# EAGLE design untitled (EAGLE 6.3)
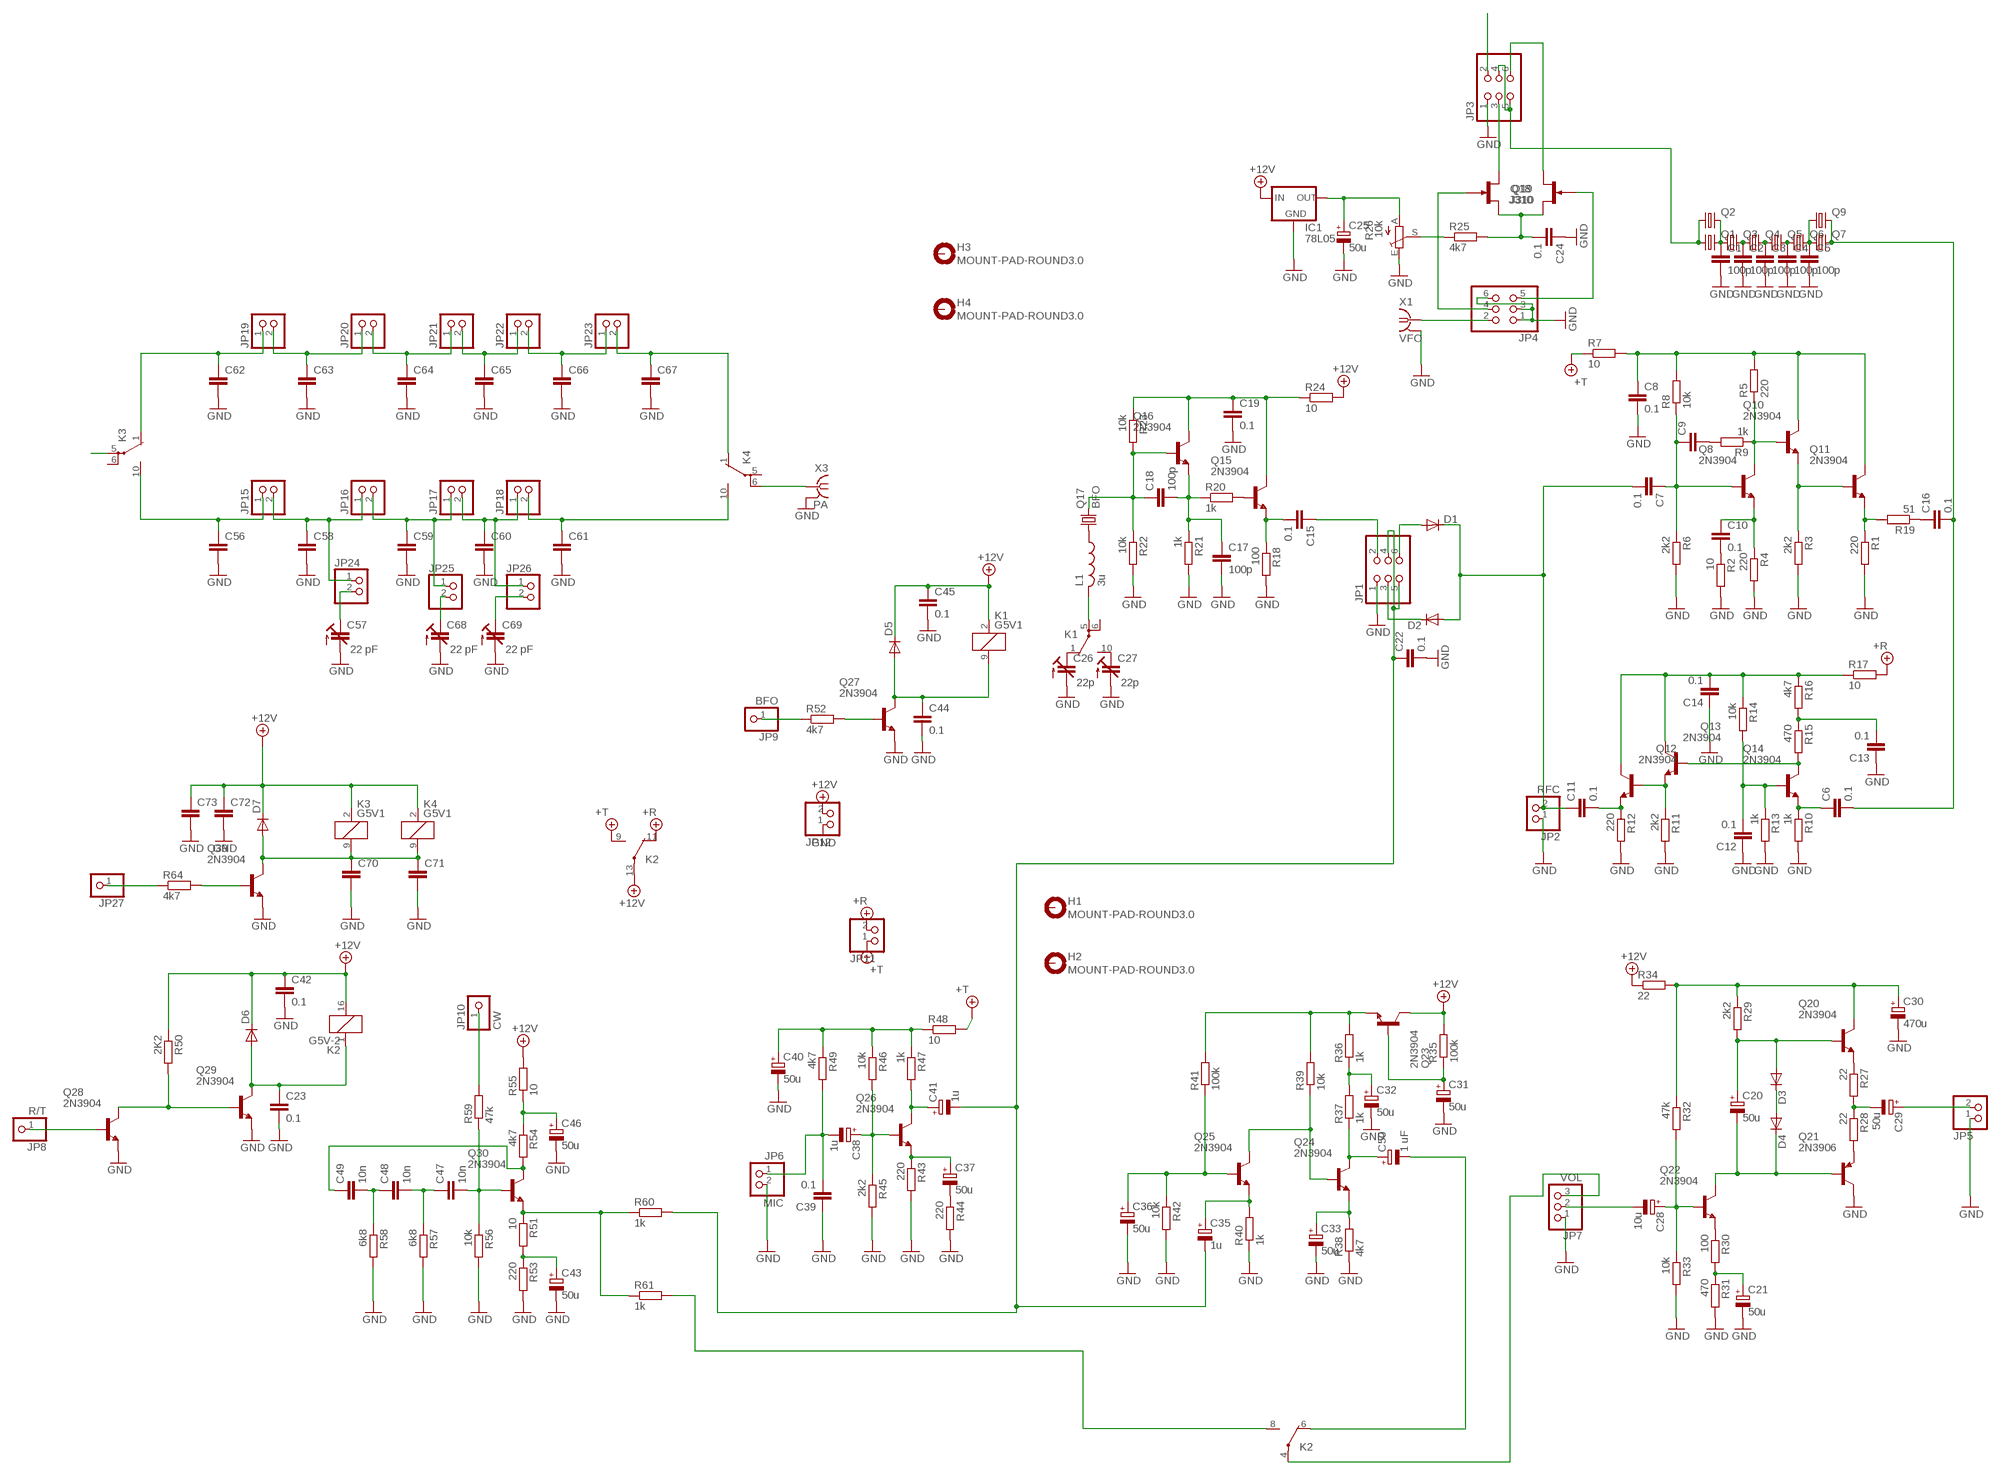
[diagram p0: schematic, sheet 1]

## Parts
C1  100p  C-EUC1206  [C1206]
C2  100p  C-EUC1206  [C1206]
C3  100p  C-EUC1206  [C1206]
C4  100p  C-EUC1206  [C1206]
C5  100p  C-EUC1206  [C1206]
C6  0.1  C-EU050-024X044  [C050-024X044]
C7  0.1  C-EU050-024X044  [C050-024X044]
C8  0.1  C-EU050-024X044  [C050-024X044]
C9  C-EU050-024X044  [C050-024X044]
C10  0.1  C-EU050-024X044  [C050-024X044]
C11  0.1  C-EU050-024X044  [C050-024X044]
C12  0.1  C-EU050-024X044  [C050-024X044]
C13  0.1  C-EU050-024X044  [C050-024X044]
C14  0.1  C-EU050-024X044  [C050-024X044]
C15  0.1  C-EU050-024X044  [C050-024X044]
C16  0.1  C-EU050-024X044  [C050-024X044]
C17  100p  C-EU050-024X044  [C050-024X044]
C18  100p  C-EU050-024X044  [C050-024X044]
C19  0.1  C-EU050-024X044  [C050-024X044]
C20  50u  CPOL-EUE2.5-5  [E2,5-5]
C21  50u  CPOL-EUE2.5-5  [E2,5-5]
C22  0.1  C-EU050-024X044  [C050-024X044]
C23  0.1  C-EU050-024X044  [C050-024X044]
C24  0.1  C-EU050-024X044  [C050-024X044]
C25  50u  CPOL-EUE2.5-5  [E2,5-5]
C26  22p  C-TRIMMTZ03  [CTRIMTZ03]
C27  22p  C-TRIMMTZ03  [CTRIMTZ03]
C28  10u  CPOL-EUE2.5-5  [E2,5-5]
C29  50u  CPOL-EUE2.5-5  [E2,5-5]
C30  470u  CPOL-EUE2.5-5  [E2,5-5]
C31  50u  CPOL-EUE2.5-5  [E2,5-5]
C32  50u  CPOL-EUE2.5-5  [E2,5-5]
C33  50u  CPOL-EUE2.5-5  [E2,5-5]
C35  1u  CPOL-EUE2.5-5  [E2,5-5]
C36  50u  CPOL-EUE2.5-5  [E2,5-5]
C37  50u  CPOL-EUE2.5-5  [E2,5-5]
C38  1u  CPOL-EUE2.5-5  [E2,5-5]
C39  0.1  C-EU050-024X044  [C050-024X044]
C40  50u  CPOL-EUE2.5-5  [E2,5-5]
C41  1u  CPOL-EUE2.5-5  [E2,5-5]
C42  0.1  C-EU050-024X044  [C050-024X044]
C43  50u  CPOL-EUE2.5-5  [E2,5-5]
C44  0.1  C-EU050-024X044  [C050-024X044]
C45  0.1  C-EU050-024X044  [C050-024X044]
C46  50u  CPOL-EUE2.5-5  [E2,5-5]
C47  10n  C-EU050-024X044  [C050-024X044]
C48  10n  C-EU050-024X044  [C050-024X044]
C49  10n  C-EU050-024X044  [C050-024X044]
C50  1 uF  CPOL-EUE5-4  [E5-4]
C56  C-EU050-024X044  [C050-024X044]
C57  22 pF  C-TRIMMTZ03  [CTRIMTZ03]
C58  C-EU050-024X044  [C050-024X044]
C59  C-EU050-024X044  [C050-024X044]
C60  C-EU050-024X044  [C050-024X044]
C61  C-EU050-024X044  [C050-024X044]
C62  C-EU050-024X044  [C050-024X044]
C63  C-EU050-024X044  [C050-024X044]
C64  C-EU050-024X044  [C050-024X044]
C65  C-EU050-024X044  [C050-024X044]
C66  C-EU050-024X044  [C050-024X044]
C67  C-EU050-024X044  [C050-024X044]
C68  22 pF  C-TRIMMTZ03  [CTRIMTZ03]
C69  22 pF  C-TRIMMTZ03  [CTRIMTZ03]
C70  C-EU050-024X044  [C050-024X044]
C71  C-EU050-024X044  [C050-024X044]
C72  C-EU050-024X044  [C050-024X044]
C73  C-EU050-024X044  [C050-024X044]
D1  DIODE-D-5  [D-5]
D2  DIODE-D-5  [D-5]
D3  DIODE-D-5  [D-5]
D4  DIODE-D-5  [D-5]
D5  DIODE-D-5  [D-5]
D6  DIODE-D-5  [D-5]
D7  DIODE-D-5  [D-5]
H1  MOUNT-PAD-ROUND3.0  [3,0-PAD]
H2  MOUNT-PAD-ROUND3.0  [3,0-PAD]
H3  MOUNT-PAD-ROUND3.0  [3,0-PAD]
H4  MOUNT-PAD-ROUND3.0  [3,0-PAD]
IC1  78L05  78LXX  [78LXX]
JP1  PINHD-2X3  [2X03]
JP2  RFC  PINHD-1X2  [1X02]
JP3  PINHD-2X3  [2X03]
JP4  PINHD-2X3  [2X03]
JP5  PINHD-1X2  [1X02]
JP6  MIC  PINHD-1X2  [1X02]
JP7  VOL  PINHD-1X3  [1X03]
JP8  R/T  PINHD-1X1  [1X01]
JP9  BFO  PINHD-1X1  [1X01]
JP10  CW  PINHD-1X1  [1X01]
JP11  PINHD-1X2  [1X02]
JP12  PINHD-1X2  [1X02]
JP15  PINHD-1X2  [1X02]
JP16  PINHD-1X2  [1X02]
JP17  PINHD-1X2  [1X02]
JP18  PINHD-1X2  [1X02]
JP19  PINHD-1X2  [1X02]
JP20  PINHD-1X2  [1X02]
JP21  PINHD-1X2  [1X02]
JP22  PINHD-1X2  [1X02]
JP23  PINHD-1X2  [1X02]
JP24  PINHD-1X2  [1X02]
JP25  PINHD-1X2  [1X02]
JP26  PINHD-1X2  [1X02]
JP27  PINHD-1X1  [1X01]
K1  G5V1  [G5V1]
K2  G5V-2  [G5V-2]
K3  G5V1  [G5V1]
K4  G5V1  [G5V1]
L1  3u  L-US0207/2V  [0207/2V]
Q1  CRYSTALHC49S  [HC49/S]
Q2  CRYSTALHC49S  [HC49/S]
Q3  CRYSTALHC49S  [HC49/S]
Q4  CRYSTALHC49S  [HC49/S]
Q5  CRYSTALHC49S  [HC49/S]
Q6  CRYSTALHC49S  [HC49/S]
Q7  CRYSTALHC49S  [HC49/S]
Q8  2N3904  [TO92]
Q9  CRYSTALHC49S  [HC49/S]
Q10  2N3904  [TO92]
Q11  2N3904  [TO92]
Q12  2N3904  [TO92]
Q13  2N3904  [TO92]
Q14  2N3904  [TO92]
Q15  2N3904  [TO92]
Q16  2N3904  [TO92]
Q17  BFO  CRYSTALHC49S  [HC49/S]
Q18  J310  [TO92R]
Q19  J310  [TO92R]
Q20  2N3904  [TO92]
Q21  2N3906  [TO92]
Q22  2N3904  [TO92]
Q23  2N3904  [TO92]
Q24  2N3904  [TO92]
Q25  2N3904  [TO92]
Q26  2N3904  [TO92]
Q27  2N3904  [TO92]
Q28  2N3904  [TO92]
Q29  2N3904  [TO92]
Q30  2N3904  [TO92]
Q39  2N3904  [TO92]
R1  220  R-EU_0204/5  [0204/5]
R2  10  R-EU_0204/5  [0204/5]
R3  2k2  R-EU_0204/5  [0204/5]
R4  220  R-EU_0204/5  [0204/5]
R5  220  R-EU_0204/5  [0204/5]
R6  2k2  R-EU_0204/5  [0204/5]
R7  10  R-EU_0204/5  [0204/5]
R8  10k  R-EU_0204/5  [0204/5]
R9  1k  R-EU_0204/5  [0204/5]
R10  1k  R-EU_0204/5  [0204/5]
R11  2k2  R-EU_0204/5  [0204/5]
R12  220  R-EU_0204/5  [0204/5]
R13  1k  R-EU_0204/5  [0204/5]
R14  10k  R-EU_0204/5  [0204/5]
R15  470  R-EU_0204/5  [0204/5]
R16  4k7  R-EU_0204/5  [0204/5]
R17  10  R-EU_0204/5  [0204/5]
R18  100  R-EU_0204/5  [0204/5]
R19  51  R-EU_0204/5  [0204/5]
R20  1k  R-EU_0204/5  [0204/5]
R21  1k  R-EU_0204/5  [0204/5]
R22  10k  R-EU_0204/5  [0204/5]
R23  10k  R-EU_0204/5  [0204/5]
R24  10  R-EU_0204/5  [0204/5]
R25  4k7  R-EU_0204/5  [0204/5]
R26  10k  TRIM_EU-CA6V  [CA6V]
R27  22  R-EU_0204/5  [0204/5]
R28  22  R-EU_0204/5  [0204/5]
R29  2k2  R-EU_0204/5  [0204/5]
R30  100  R-EU_0204/5  [0204/5]
R31  470  R-EU_0204/5  [0204/5]
R32  47k  R-EU_0204/5  [0204/5]
R33  10k  R-EU_0204/5  [0204/5]
R34  22  R-EU_0204/5  [0204/5]
R35  100k  R-EU_0204/5  [0204/5]
R36  1k  R-EU_0204/5  [0204/5]
R37  1k  R-EU_0204/5  [0204/5]
R38  4k7  R-EU_0204/5  [0204/5]
R39  10k  R-EU_0204/5  [0204/5]
R40  1k  R-EU_0204/5  [0204/5]
R41  100k  R-EU_0204/5  [0204/5]
R42  10k  R-EU_0204/5  [0204/5]
R43  220  R-EU_0204/5  [0204/5]
R44  220  R-EU_0204/5  [0204/5]
R45  2k2  R-EU_0204/5  [0204/5]
R46  10k  R-EU_0204/5  [0204/5]
R47  1k  R-EU_0204/5  [0204/5]
R48  10  R-EU_0204/5  [0204/5]
R49  4k7  R-EU_0204/5  [0204/5]
R50  2K2  R-EU_0204/5  [0204/5]
R51  10  R-EU_0204/5  [0204/5]
R52  4k7  R-EU_0204/5  [0204/5]
R53  220  R-EU_0204/5  [0204/5]
R54  4k7  R-EU_0204/5  [0204/5]
R55  10  R-EU_0204/5  [0204/5]
R56  10k  R-EU_0204/5  [0204/5]
R57  6k8  R-EU_0204/5  [0204/5]
R58  6k8  R-EU_0204/5  [0204/5]
R59  47k  R-EU_0204/5  [0204/5]
R60  1k  R-EU_0204/5  [0204/5]
R61  1k  R-EU_0204/5  [0204/5]
R64  4k7  R-EU_0204/5  [0204/5]
X1  VFO  BU-SMA-V  [BU-SMA-V]
X3  PA  BU-SMA-V  [BU-SMA-V]

## Nets
+5V/1: JP11.2 K2.11(2:O) R17.2 ; supply symbol labelled +R
+5V/2: JP11.1 K2.9(2:S) R7.1 R48.2 ; supply symbol labelled +T
+12V: C42.1 C45.1 C72.1 C73.1 D5.C D6.C D7.C IC1.IN JP12.2 K1.2 K2.13(2:P) K2.16 K3.2 K4.2 Q23.1(C) R24.2 R34.1 R35.2 R50.1 R55.2
GND: C1.2 C2.2 C3.2 C4.2 C5.2 C8.2 C12.1 C13.1 C14.1 C17.2 C19.2 C21.- C22.2 C23.2 C24.1 C25.- C26.2(A) C27.2(A) C30.- C31.- C32.- C33.- C36.- C39.1 C40.- C42.2 C43.- C44.2 C45.2 C46.- C56.2 C57.2(A) C58.2 C59.2 C60.2 C61.2 C62.2 C63.2 C64.2 C65.2 C66.2 C67.2 C68.2(A) C69.2(A) C70.2 C71.2 C72.2 C73.2 IC1.GND JP1.1 JP2.1 JP3.1 JP4.1 JP4.3 JP4.6 JP5.1 JP6.2 JP7.1 JP12.1 Q21.1(C) Q27.3(E) Q28.3(E) Q29.3(E) Q39.3(E) R1.2 R2.2 R3.2 R4.2 R6.2 R10.2 R11.2 R12.2 R13.2 R18.2 R21.2 R22.2 R26.E R31.2 R33.2 R38.1 R40.1 R42.2 R43.2 R44.2 R45.2 R53.2 R56.2 R57.2 R58.2 X1.2(GND) X3.2(GND)
N$1: C1.1 Q1.2 Q2.2 Q3.1
N$2: C2.1 Q3.2 Q4.1
N$3: C3.1 Q4.2 Q5.1
N$4: C4.1 Q5.2 Q6.1
N$5: C5.1 Q6.2 Q7.1 Q9.1
N$6: C6.2 C16.2 Q7.2 Q9.2
N$7: C26.1(E) K1.1(2:O)
N$8: C10.1 Q8.3(E) R4.1
N$9: C10.2 R2.1
N$10: C7.1 C9.1 Q8.2(B) R6.1 R8.1
N$11: Q8.1(C) Q10.2(B) R5.1 R9.1
N$12: Q10.3(E) Q11.2(B) R3.1
N$13: Q11.3(E) R1.1 R19.2
N$14: C8.1 Q10.1(C) Q11.1(C) R5.2 R7.2 R8.2
N$15: C16.1 R19.1
N$16: C9.2 R9.2
N$17: Q12.2(B) Q13.3(E) R11.1
N$18: C11.2 Q12.3(E) R12.1
N$19: C14.2 Q12.1(C) Q13.1(C) R14.1 R16.1 R17.1
N$20: C27.1(E) K1.10(2:S)
N$21: C12.2 Q14.2(B) R13.1 R14.2
N$22: C6.1 Q14.3(E) R10.1
N$23: Q13.2(B) Q14.1(C) R15.2
N$24: C13.2 R15.1 R16.2
N$25: C15.2 Q15.3(E) R18.1
N$26: Q15.2(B) R20.2
N$27: C17.1 C18.2 Q16.3(E) R20.1 R21.1
N$28: C19.1 Q15.1(C) Q16.1(C) R23.1 R24.1
N$29: C15.1 JP1.2
N$30: C18.1 Q16.2(B) Q17.2 R22.1 R23.2
N$31: L1.1 Q17.1
N$32: K1.5(2:P) L1.2
N$33: R25.1 R26.S
N$34: Q20.3(E) R27.1
N$35: Q27.2(B) R52.2
N$36: D1.A JP1.6
N$37: D2.C JP1.3
N$38: C7.2 C11.1 D1.C D2.A JP2.2
N$39: JP3.4 JP3.5 Q1.1 Q2.1
N$40: JP3.3 Q18.D
N$41: JP3.6 Q19.D
N$42: C24.2 Q18.S Q19.S R25.2
N$43: JP4.5 Q19.G
N$44: JP4.4 Q18.G
N$45: C29.- R27.2 R28.1
N$46: JP4.2 X1.1
N$47: Q21.3(E) R28.2
N$48: C25.+ IC1.OUT R26.A
N$49: D3.C D4.A
N$50: C20.- D4.C Q21.2(B) Q22.1(C)
N$51: C20.+ D3.A Q20.2(B) R29.2
N$52: C30.+ Q20.1(C) R29.1 R32.1 R34.2
N$53: Q22.3(E) R30.1
N$54: C21.+ R30.2 R31.1
N$55: C28.+ Q22.2(B) R32.2 R33.1
N$56: C29.+ JP5.2
N$57: C28.- JP7.2
N$58: C31.+ Q23.2(B) R35.1
N$59: Q23.3(E) R36.2 R39.2 R41.2
N$60: C32.+ R36.1 R37.2
N$61: C50.+ Q24.1(C) R37.1
N$62: C33.+ Q24.3(E) R38.2
N$63: Q24.2(B) Q25.1(C) R39.1
N$64: JP9.1 R52.1
N$65: C35.+ Q25.3(E) R40.2
N$66: C36.+ Q25.2(B) R41.1 R42.1
N$67: C37.+ Q26.3(E) R43.1
N$68: C37.- R44.1
N$69: C38.+ Q26.2(B) R45.1 R46.2
N$70: C41.+ Q26.1(C) R47.2
N$71: C40.+ R46.1 R47.1 R48.1 R49.1
N$72: C38.- C39.2 JP6.1 R49.2
N$73: JP7.3 K2.4(1:P)
N$74: C22.1 C35.- C41.- JP1.4 JP1.5 R60.2
N$75: C50.- K2.6(1:O)
N$76: JP8.1 Q28.2(B)
N$77: C23.1 D6.A K2.1 Q29.1(C)
N$78: Q28.1(C) Q29.2(B) R50.2
N$79: C44.1 D5.A K1.9 Q27.1(C)
N$81: Q30.3(E) R51.1 R60.1 R61.1
N$82: C43.+ R51.2 R53.1
N$83: C49.1 Q30.1(C) R54.2
N$84: C46.+ R54.1 R55.1
N$85: C47.2 Q30.2(B) R56.1 R59.1
N$86: C47.1 C48.2 R57.1
N$87: C48.1 C49.2 R58.1
N$89: JP10.1 R59.2
N$91: K2.8(1:S) R61.2
N$104: C56.1 JP15.1 K3.10(2:S)
N$105: C58.1 JP15.2 JP16.1 JP24.1
N$106: C59.1 JP16.2 JP17.1 JP25.1
N$107: C60.1 JP17.2 JP18.1 JP26.1
N$108: C61.1 JP18.2 K4.10(2:S)
N$109: C62.1 JP19.1 K3.1(2:O)
N$110: C63.1 JP19.2 JP20.1
N$111: C64.1 JP20.2 JP21.1
N$112: C65.1 JP21.2 JP22.1
N$113: C66.1 JP22.2 JP23.1
N$114: C67.1 JP23.2 K4.1(2:O)
N$115: K4.6(2:P) X3.1
N$116: JP3.2 K3.5(2:P)
N$117: C57.1(E) JP24.2
N$118: C68.1(E) JP25.2
N$119: C69.1(E) JP26.2
N$120: Q39.2(B) R64.2
N$121: JP27.1 R64.1
N$122: C70.1 C71.1 D7.A K3.9 K4.9 Q39.1(C)
Unconnected: H1.B3,0(MOUNT) H2.B3,0(MOUNT) H3.B3,0(MOUNT) H4.B3,0(MOUNT) K1.6(2:P) K3.6(2:P) K4.5(2:P)

## Power pins joined to a net without a drawn wire
GND: X1.3(GND) X1.4(GND) X1.5(GND) X3.3(GND) X3.4(GND) X3.5(GND)

## Library data of the parts
C1-C19 C22-C24 C39 C42 C44 C45 C47-C49 C56 C58-C67 C70-C73 = rcl:C-EU: CAPACITOR, European symbol
C20 C21 C25 C28-C33 C35-C38 C40 C41 C43 C46 C50 = rcl:CPOL-EU: POLARIZED CAPACITOR, European symbol
C26 C27 C57 C68 C69 = rcl:C-TRIMM: Trimm capacitor
D1-D7 = diode:DIODE-: DIODE
H1-H4 = holes:MOUNT-PAD-ROUND: MOUNTING PAD, round
IC1 = v-reg:78LXX: VOLTAGE REGULATOR
JP1 JP3 JP4 = pinhead:PINHD-2X3: PIN HEADER
JP2 JP5 JP6 JP11 JP12 JP15-JP26 = pinhead:PINHD-1X2: PIN HEADER
JP7 = pinhead:PINHD-1X3: PIN HEADER
JP8-JP10 JP27 = pinhead:PINHD-1X1: PIN HEADER
K1 K3 K4 = relay:G5V1: RELAY 1 x switch, 0.5 A/125 V AC, 1 A/24 V DC , Omron; MPN: G5V-1-DC24; OC_FARNELL: 9949593; OC_NEWARK: 36M6377
K2 = relay:G5V-2: OMRON PCB Relay Source: http://www.omron.com/ecb/products/pdf/en-g5v2.pdf; MPN: G5V-2 5DC; OC_FARNELL: 9949488; OC_NEWARK: 78K5703
L1 = rcl:L-US: INDUCTOR, American symbol
Q1-Q7 Q9 Q17 = crystal:CRYSTAL: CRYSTAL; OC_FARNELL: 1667008; OC_NEWARK: unknown
Q8 Q10-Q16 Q20 Q22-Q30 Q39 = transistor-npn:2N3904: NPN Transistor
Q18 Q19 = transistor-small-signal:J310: N-Channel RF Amplifier J309, J310 Source: http://www.fairchildsemi.com/pf/J3/J310.html
Q21 = transistor-pnp:2N3906: PNP Transistor
R1-R25 R27-R61 R64 = rcl:R-EU_: RESISTOR, European symbol
R26 = pot:TRIM_EU-: POTENTIOMETER
X1 X3 = con-coax:BU-SMA-V: FEMALE SMA CONNECTOR Radiall distributor RS 112-3794; OC_FARNELL: unknown; OC_NEWARK: unknown

## Board
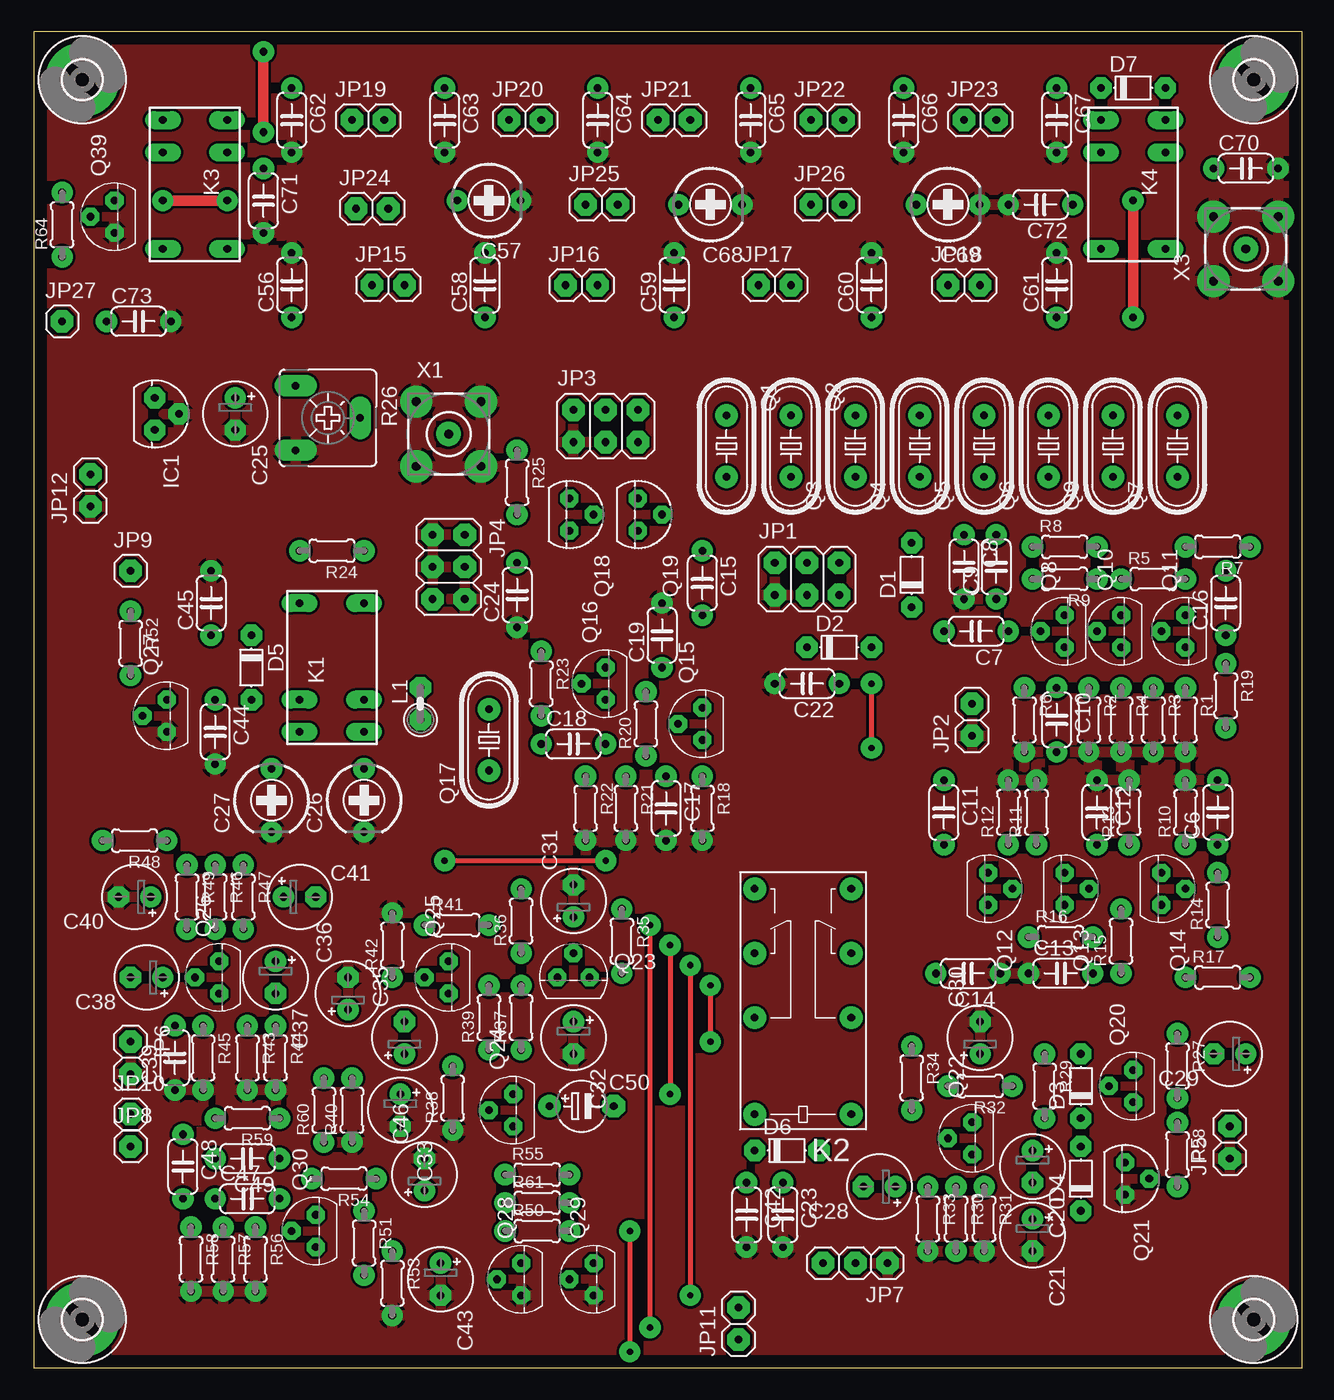
[diagram p1: board, top side]
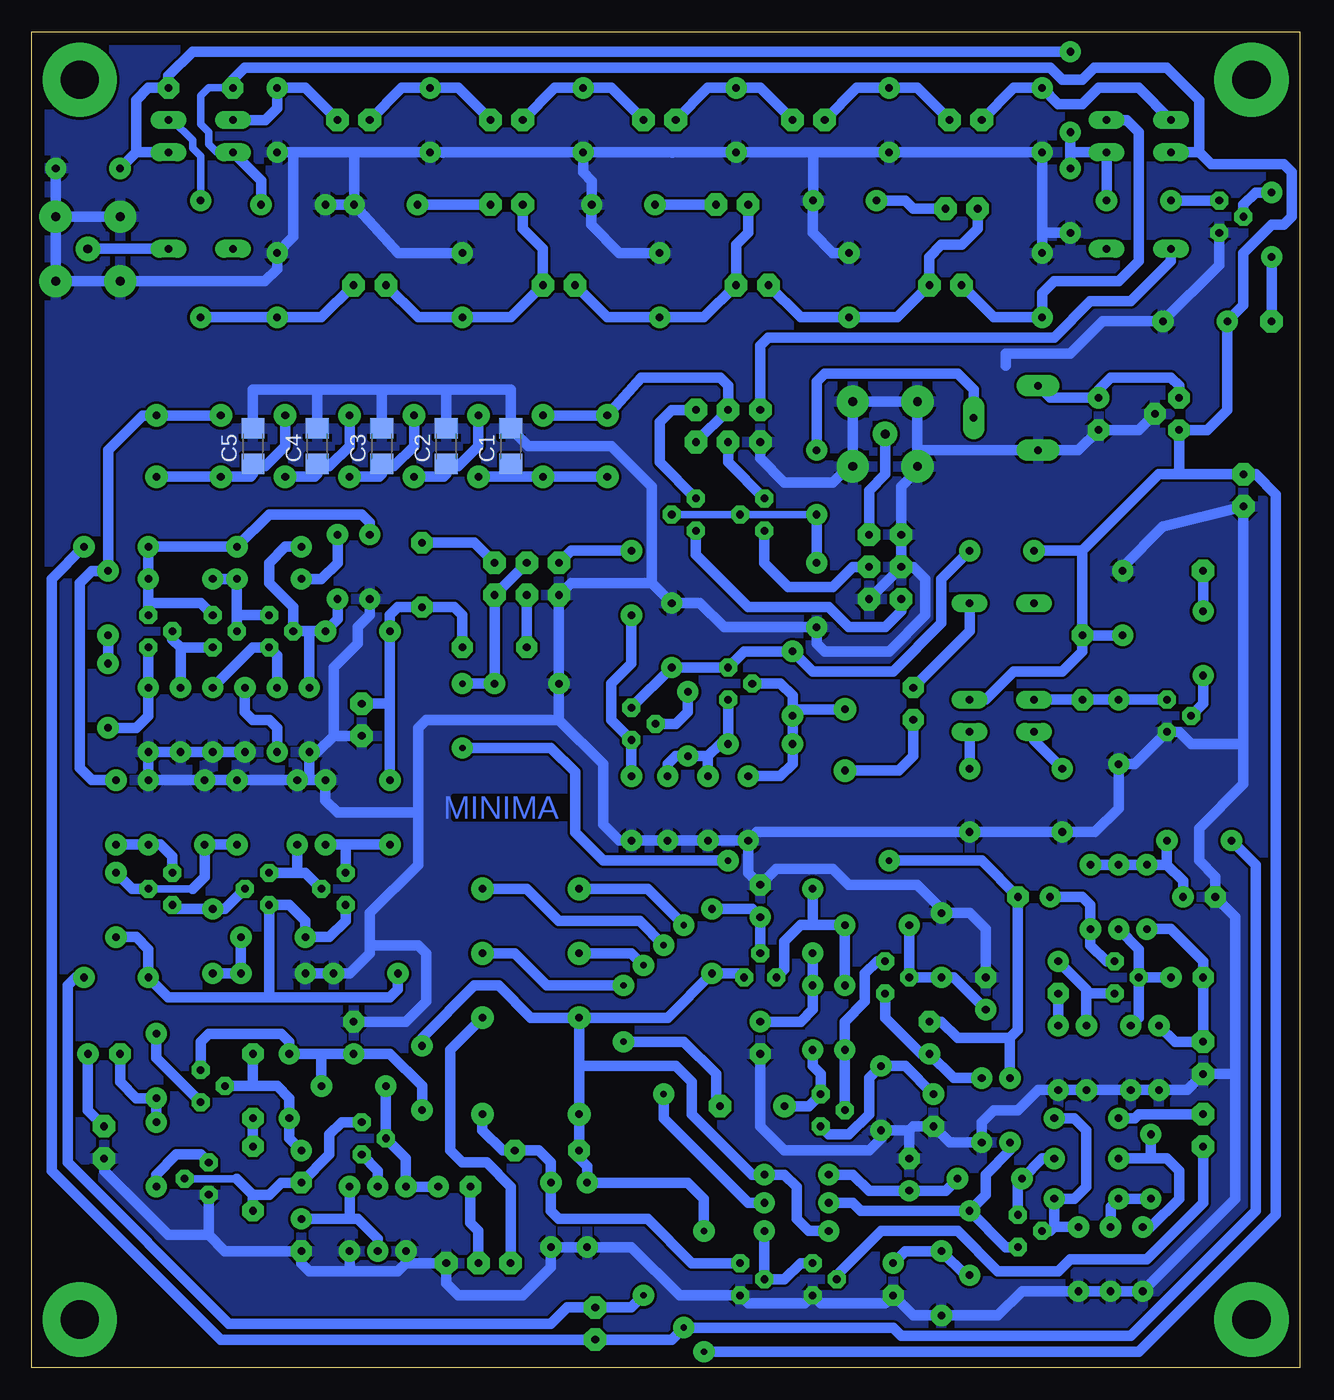
[diagram p2: board, bottom side, seen from below]

Size 100 x 105.4 mm. Coordinates in mm from the lower left corner, seen from the top.
Outline: 0,80 0,0 100,0 100,105.4 0,105.4 0,79.69
Copper layers (1*16): Top 0.035mm / dielectric 1.5mm / Bottom 0.035mm
Design rules "default": minimum track width 10mil, minimum drill 24mil, track to track 8mil, track to pad 8mil, pad to pad 8mil, via to via 8mil, smd to smd 8mil, copper to edge 40mil, drill to drill 8mil, minimum pad ring 10mil, minimum via ring 8mil, stop-mask expansion 4mil, vias tented up to drill 0mil, thermal gap 10mil

### Footprints (pad centres in the part's own frame; a part is rotated, then mirrored left to right if it is on the bottom)
C1206 = smd 1.6 x 1.8: 1 -1.4,0; 2 1.4,0
C050-024X044 = drill 0.6 pad 1.676: 1 -2.54,0; 2 2.54,0
E2,5-5 = drill 0.6 pad 1.676: + -1.27,0 | drill 0.6 pad 1.676 octagon: - 1.27,0
CTRIMTZ03 = drill 0.6 pad 1.676: 1 0,2.5; 2 0,-2.5
E5-4 = drill 0.6 pad 1.778: + -2.54,0 | drill 0.6 pad 1.778 octagon: - 2.54,0
D-5 = drill 0.6 pad 1.676 octagon: A 2.54,0; C -2.54,0
3,0-PAD = drill 3 pad 5.842: B3,0 0,0
78LXX = drill 0.6 pad 1.676 octagon: GND 0,1.905; IN 1.27,0; OUT -1.27,0
2X03 = drill 0.6 pad 1.778 octagon: 1 -2.54,-1.27; 2 -2.54,1.27; 3 0,-1.27; 4 0,1.27; 5 2.54,-1.27; 6 2.54,1.27
1X02 = drill 0.6 pad 1.778 octagon: 1 -1.27,0; 2 1.27,0
1X03 = drill 0.6 pad 1.778 octagon: 1 -2.54,0; 2 0,0; 3 2.54,0
1X01 = drill 0.6 pad 1.778 octagon: 1 0,0
G5V1 = drill 0.6 pad 1.422 long: 1 -5.08,-2.54; 2 -2.54,-2.54; 5 5.08,-2.54; 6 5.08,2.54; 9 -2.54,2.54; 10 -5.08,2.54
G5V-2 = drill 0.6 pad 1.8: 1 -8.89,-3.81; 4 -1.27,-3.81; 6 3.81,-3.81; 8 8.89,-3.81; 9 8.89,3.81; 11 3.81,3.81; 13 -1.27,3.81; 16 -8.89,3.81
0207/2V = drill 0.6 pad 1.676 octagon: 1 -1.27,0; 2 1.27,0
HC49/S = drill 0.6 pad 1.778: 1 -2.413,0; 2 2.413,0
TO92 = drill 0.6 pad 1.422 octagon: 1 1.27,0; 2 0,1.905; 3 -1.27,0
TO92R = drill 0.6 pad 1.422 octagon: D -1.27,0; G 1.27,0; S 0,1.905
0204/5 = drill 0.6 pad 1.676: 1 -2.54,0; 2 2.54,0
CA6V = drill 0.6 pad 1.676 long: A -2.54,-2.54; E 2.54,-2.54; S 0,2.54
BU-SMA-V = drill 0.7 pad 1.93: 1 0,0 | drill 0.7 pad 2.54: 2 -2.55,2.55; 3 2.55,2.55; 4 2.55,-2.55; 5 -2.55,-2.55

### Placement (x,y rotation side)
C1  62.23,72.71 90 bottom
C2  67.31,72.71 90 bottom
C3  72.39,72.71 90 bottom
C4  77.47,72.71 90 bottom
C5  82.55,72.71 90 bottom
C6  93.34,43.81 90 top
C7  74.3,58.1 180 top
C8  73.34,63.18 270 top
C9  75.88,63.18 90 top
C10  80.64,51.12 270 top
C11  71.75,43.81 270 top
C12  83.82,43.81 270 top
C13  80.96,31.11 0 top
C14  73.66,31.11 180 top
C15  52.7,61.91 270 top
C16  93.98,60.33 90 top
C17  49.85,44.13 270 top
C18  42.55,49.21 0 top
C19  49.53,57.78 90 top
C20  78.74,15.88 270 top
C21  78.74,10.48 270 top
C22  60.96,53.98 180 top
C23  59.05,12.06 270 top
C24  38.1,60.96 90 top
C25  15.88,75.25 270 top
C26  26.04,44.77 0 top
C27  18.73,44.77 0 top
C28  66.67,14.29 180 top
C29  94.3,24.77 180 top
C30  74.61,26.04 90 top
C31  42.55,36.83 90 top
C32  42.55,26.04 270 top
C33  28.89,20.32 270 top
C35  29.21,26.04 90 top
C36  24.77,29.53 90 top
C37  19.05,30.8 270 top
C38  8.89,30.8 180 top
C39  11.11,24.45 90 top
C40  7.94,37.15 180 top
C41  20.95,37.15 0 top
C42  56.2,12.06 270 top
C43  32.07,6.99 270 top
C44  14.29,50.16 270 top
C45  13.97,60.33 90 top
C46  30.8,15.24 90 top
C47  16.83,13.34 0 top
C48  11.75,15.88 270 top
C49  16.83,16.51 180 top
C50  43.18,20.64 0 top
C56  20.32,85.41 90 top
C57  35.88,92.08 90 top
C58  35.56,85.41 90 top
C59  50.48,85.41 90 top
C60  66.04,85.41 90 top
C61  80.64,85.41 90 top
C62  20.32,98.42 270 top
C63  32.38,98.42 270 top
C64  44.45,98.42 270 top
C65  56.52,98.42 270 top
C66  68.58,98.42 270 top
C67  80.64,98.42 270 top
C68  53.34,91.76 90 top
C69  72.07,91.76 90 top
C70  95.57,94.61 0 top
C71  18.1,92.08 270 top
C72  79.38,91.76 180 top
C73  8.26,82.55 0 top
D1  69.22,62.55 90 top
D2  63.5,56.83 0 top
D3  82.55,22.23 90 top
D4  82.55,14.92 90 top
D5  17.14,55.24 270 top
D6  59.37,17.14 0 top
D7  86.68,100.97 0 top
H1  3.81,3.81 0 top
H2  96.2,3.81 0 top
H3  3.81,101.6 0 top
H4  96.2,101.6 0 top
IC1  9.53,75.25 270 top
JP1  60.96,62.23 0 top
JP2  73.98,51.12 90 top
JP3  45.09,74.3 0 top
JP4  32.7,63.18 270 top
JP5  94.3,17.78 90 top
JP6  7.62,24.45 270 top
JP7  64.77,8.26 180 top
JP8  7.62,17.46 0 top
JP9  7.62,62.87 0 top
JP10  7.62,20 0 top
JP11  55.56,3.49 90 top
JP12  4.45,69.22 90 top
JP15  27.94,85.41 0 top
JP16  43.18,85.41 0 top
JP17  58.42,85.41 0 top
JP18  73.34,85.41 0 top
JP19  26.35,98.42 0 top
JP20  38.73,98.42 0 top
JP21  50.48,98.42 0 top
JP22  62.55,98.42 0 top
JP23  74.61,98.42 0 top
JP24  26.67,91.44 0 top
JP25  44.77,91.76 0 top
JP26  62.55,91.76 0 top
JP27  2.22,82.55 0 top
K1  23.5,55.24 90 top
K2  60.64,28.89 90 top
K3  12.7,93.34 270 top
K4  86.68,93.34 270 top
L1  30.48,52.39 90 top
Q1  54.61,72.71 270 top
Q2  59.69,72.71 270 top
Q3  64.77,72.71 90 top
Q4  69.85,72.71 90 top
Q5  74.93,72.71 90 top
Q6  80.01,72.71 90 top
Q7  90.17,72.71 90 top
Q8  81.28,58.1 90 top
Q9  85.09,72.71 90 top
Q10  85.72,58.1 90 top
Q11  90.81,58.1 90 top
Q12  75.25,37.78 270 top
Q13  81.28,37.78 270 top
Q14  88.9,37.78 270 top
Q15  52.7,50.8 90 top
Q16  45.09,53.98 90 top
Q17  35.88,49.53 90 top
Q18  42.23,67.31 270 top
Q19  47.62,67.31 270 top
Q20  86.68,22.23 90 top
Q21  86.04,14.92 270 top
Q22  73.98,18.1 90 top
Q23  42.55,30.8 0 top
Q24  37.78,20.32 90 top
Q25  32.7,30.8 90 top
Q26  14.61,30.8 90 top
Q27  10.48,51.44 90 top
Q28  38.42,6.99 90 top
Q29  44.13,6.99 90 top
Q30  22.23,10.79 90 top
Q39  6.35,90.81 90 top
R1  90.81,51.12 270 top
R2  83.19,51.12 270 top
R3  88.27,51.12 270 top
R4  85.72,51.12 270 top
R5  88.27,62.23 0 top
R6  78.11,51.12 270 top
R7  93.34,64.77 180 top
R8  81.28,64.77 0 top
R9  81.28,62.23 180 top
R10  90.81,43.81 90 top
R11  79.06,43.81 90 top
R12  76.83,43.81 90 top
R13  86.36,43.81 90 top
R14  93.34,36.51 90 top
R15  85.72,33.66 90 top
R16  80.96,33.97 0 top
R17  93.34,30.8 0 top
R18  52.7,44.13 270 top
R19  93.98,53.02 270 top
R20  48.26,50.8 90 top
R21  46.67,44.13 270 top
R22  43.5,44.13 270 top
R23  40.01,53.98 270 top
R24  23.5,64.45 180 top
R25  38.1,69.85 270 top
R26  23.18,74.93 270 top
R27  90.17,23.81 270 top
R28  90.17,16.83 270 top
R29  79.69,22.23 270 top
R30  72.71,11.75 270 top
R31  74.93,11.75 270 top
R32  74.61,22.23 180 top
R33  70.48,11.75 270 top
R34  69.22,22.86 270 top
R35  46.35,33.66 270 top
R36  38.42,35.24 90 top
R37  38.42,27.62 90 top
R38  33.02,21.27 90 top
R39  35.88,27.62 90 top
R40  25.08,20.32 90 top
R41  33.34,34.92 0 top
R42  28.26,33.34 90 top
R43  16.83,24.45 270 top
R44  19.05,24.45 270 top
R45  13.34,24.45 270 top
R46  14.29,37.15 270 top
R47  16.51,37.15 270 top
R48  7.94,41.59 180 top
R49  12.06,37.15 270 top
R50  39.69,10.79 0 top
R51  26.04,9.84 270 top
R52  7.62,57.15 270 top
R53  28.26,6.67 270 top
R54  24.45,14.92 180 top
R55  39.69,15.24 0 top
R56  17.46,8.57 270 top
R57  14.92,8.57 270 top
R58  12.38,8.57 270 top
R59  16.83,19.68 180 top
R60  22.86,20.32 90 top
R61  39.69,13.02 0 top
R64  2.22,90.17 90 top
X1  32.7,73.66 0 top
X3  95.57,88.27 90 top

### Tracks (layer width: path | path; a pad name or v marks a point on that pad's centre or on a via)
+5V/1  (via drill 0.5 pad 1.68)
  Top 0.406: v51.75,31.75 v51.75,5.71
  Bottom 0.813: R17.2 96.52,30.8 97.16,30.16 97.16,16.19 84.45,3.49 59.05,3.49 57.78,4.76 JP11.2 52.7,4.76 v51.75,5.71 | K2.11 52.7,32.7 v51.75,31.75
+5V/2  (via drill 0.5 pad 1.68)
  Top 0.406: v48.58,34.92 v48.58,3.17
  Bottom 0.813: R7.1 98.42,62.23 98.42,15.56 85.09,2.22 JP11.1 49.53,2.22 v48.58,3.17 32.07,3.17 31.43,2.54 13.34,2.54 3.49,12.38 3.49,39.69 R48.2 | K2.9 51.44,37.78 v48.58,34.92
+12V  (via drill 0.5 pad 1.68)
  Top 0.406: v46.99,10.79 v46.99,1.27
  Bottom 0.61: K4.2 85.41,95.89 86.04,96.52 86.04,97.47 86.68,98.11 86.68,100.33 86.04,100.97 D7.C
  Bottom 0.813: 56.83,23.81 K2.16 D6.C 56.83,16.51 56.2,15.88 C42.1 48.26,14.61 46.99,13.34 v46.99,10.79 | 56.83,23.81 K2.13 | K2.13 49.85,27.62 R35.2 44.13,31.11 Q23.1 | 56.83,23.81 49.21,23.81 47.94,22.54 47.94,20 43.18,15.24 R55.2 40.64,15.24 39.69,14.29 39.69,11.75 38.73,10.79 R50.1 | K1.2 24.77,52.7 22.54,54.93 18.73,54.93 17.14,56.52 D5.C | C45.1 D5.C | R34.1 69.22,26.04 65.09,30.16 63.18,30.16 60.64,27.62 K2.13 | v46.99,1.27 12.7,1.27 1.91,12.06 1.91,68.9 3.49,70.48 JP12.2 9.84,70.48 | R24.2 17.14,64.45 | 17.14,64.45 D5.C | 17.14,64.45 11.11,70.48 9.84,70.48 | 9.84,70.48 9.53,70.8 IC1.IN 7.3,73.98 5.71,75.56 C73.1 4.45,83.82 4.45,87.95 2.22,90.17 1.27,90.17 0.64,90.81 0.64,94.3 1.27,94.93 6.99,94.93 7.94,95.89 | D7.C 84.14,101.6 83.19,102.55 19.68,102.55 18.73,101.6 17.14,101.6 16.19,102.55 10.48,102.55 7.94,100.01 7.94,95.89 | K4.2 81.92,93.66 C72.1 | K3.2 7.94,95.89
GND
  Bottom 0.813: R2.2 R4.2 R3.2 R1.2 R10.2 R13.2 C12.1 R11.2 78.11,46.35 | 76.2,49.85 76.2,55.24 74.3,57.15 74.3,58.42 73.34,59.37 C8.2 | 78.11,46.35 R12.2 76.83,44.77 75.88,43.81 69.53,43.81 | C14.1 C13.1 74.93,31.11 73.34,32.7 73.34,33.66 | 73.34,33.66 73.34,35.88 69.53,39.69 69.53,43.81 | R22.2 R21.2 C17.2 R18.2 53.66,41.59 54.93,42.86 54.93,47.62 58.42,51.12 | JP2.1 76.2,49.85 | JP4.3 JP4.1 31.43,69.53 30.16,70.8 30.16,73.64 X1.5 | JP4.3 JP4.6 | Q21.1 86.04,10.48 | 86.04,10.48 89.22,10.48 94.3,15.56 JP5.1 | R33.2 70.48,8.26 | 70.48,8.26 71.12,7.62 74.61,7.62 | 74.61,7.62 78.11,7.62 78.74,8.26 C21.- 84.77,9.21 86.04,10.48 | R31.2 74.93,7.94 74.61,7.62 | C36.- 24.77,34.61 26.04,35.88 R42.2 28.26,36.2 30.16,38.1 35.56,38.1 36.83,39.37 41.27,39.37 C31.- 43.5,39.05 R22.2 | C30.- 70.48,27.3 68.9,28.89 68.9,32.7 69.53,33.34 73.03,33.34 73.34,33.66 | JP3.1 42.55,71.75 40.64,69.85 36.83,69.85 35.24,71.44 35.24,73.64 X1.4 X1.3 30.16,76.2 30.15,76.19 | X1.5 30.15,76.19 | 30.15,76.19 X1.2 | X1.5 30.14,72.39 R26.E 17.46,72.39 C25.- 12.7,73.98 IC1.GND | 58.42,51.12 68.9,51.12 69.53,50.48 69.53,43.81 | 51.12,61.91 C19.2 47.31,60.33 45.4,58.42 C24.1 38.1,57.15 37.47,56.52 32.38,56.52 29.53,59.37 29.53,62.23 30.48,63.18 JP4.3 | 70.48,8.26 JP7.1 67.31,6.67 66.36,5.71 61.28,5.71 59.05,7.94 C23.2 C42.2 52.7,9.53 48.9,5.71 Q29.3 43.5,5.08 39.05,5.08 Q28.3 37.78,5.08 32.7,5.08 C43.- 30.48,4.13 R53.2 23.81,4.13 21.91,6.03 R56.2 R57.2 R58.2 5.08,13.34 5.08,23.18 | R22.2 42.82,42.27 C26.2 C27.2 16.15,42.27 14.29,44.13 C44.2 13.02,47.62 Q27.3 9.53,50.16 8.57,49.21 4.45,49.21 | 51.12,61.91 57.47,61.91 JP1.1 C22.2 58.42,51.12
  Bottom 0.813: 51.12,61.91 51.12,69.53 54.29,72.71 60.83,72.71 C1.2 62.23,77.15 67.31,77.15 | C32.- 42.55,19.05 40.64,17.14 33.97,17.14 33.02,18.1 R38.1 30.8,18.73 | C46.- 30.8,18.73 | 30.8,18.73 30.48,19.05 C33.- 27.62,17.78 R40.1 25.08,19.37 24.13,20.32 22.23,20.32 20.64,21.91 R44.2 R43.2 R45.2 C39.1 8.89,21.91 JP6.2 5.08,23.18 | 5.08,23.18 5.08,35.56 C40.- 6.67,38.73 7.94,40.01 7.94,42.55 4.45,46.04 4.45,49.21 | C2.2 67.31,77.15 | 67.31,77.15 72.07,77.15 | 72.07,77.15 72.39,77.15 | 72.39,77.15 C3.2 72.39,76.83 72.07,77.15 | 72.39,77.15 77.47,77.15 | C4.2 77.47,77.15 | 77.47,77.15 82.55,77.15 C5.2 | 4.45,49.21 JP12.1 10.79,66.36 13.97,63.18 C45.2 | 78.11,46.35 R6.2 77.47,48.58 76.2,49.85 | C63.2 C62.2 20.32,89.53 | C63.2 31.75,95.89 31.71,95.84 | C63.2 38.42,95.89 | 38.42,95.89 C64.2 49.53,95.89 | 49.53,95.89 C65.2 | C65.2 67.63,95.89 | 67.63,95.89 C66.2 74.93,95.89 | 74.93,95.89 79.38,95.89 | 79.38,95.89 C67.2 | C56.2 20.32,89.53 | 49.49,95.84 49.53,95.89 | 67.59,95.84 67.63,95.89 | C69.2 74.57,95.84 74.93,95.89 | C60.2 71.08,87.95 C69.2 | C59.2 53.66,87.95 55.88,90.17 55.88,91.72 C68.2 55.84,93.62 56.52,94.3 C65.2 | C58.2 36.83,87.95 38.42,89.53 38.42,92.03 C57.2 38.38,95.84 38.42,95.89 | X3.4 X3.3 93.01,90.81 | X3.4 X3.5 X3.2 81.61,85.72 80.64,86.68 C61.2 79.38,89.22 79.38,95.89 | X3.4 C70.2 | C72.2 C69.2 | C71.2 20.32,89.53 | 23.18,79.06 23.18,80.01 18.1,80.01 15.56,82.55 C73.2 6.35,87 Q39.3
  pour Bottom: -1.27,106.68 101.6,106.68 101.6,-1.27 -1.27,-1.27
  pour Top: -2.54,107.95 102.87,107.95 102.87,-2.54 -2.54,-2.54
N$1
  Bottom 0.813: Q1.2 Q2.2 62.23,70.29 | 62.23,70.29 Q3.1 | C1.1 62.23,70.29
N$2
  Bottom 0.813: Q4.1 67.5,70.29 67.31,70.48 C2.1 67.12,71.12 66.36,71.12 64.77,72.71 Q3.2
N$3
  Bottom 0.813: Q4.2 69.85,72.71 71.44,71.12 72.2,71.12 C3.1 72.39,70.48 72.58,70.29 Q5.1
N$4
  Bottom 0.813: Q6.1 77.66,70.29 77.47,70.48 C4.1 77.28,71.12 76.52,71.12 74.93,72.71 Q5.2
N$5
  Bottom 0.813: Q7.1 Q9.1 82.74,70.29 82.55,70.48 C5.1 82.36,71.12 81.6,71.12 80.01,72.71 Q6.2
N$6
  Bottom 0.813: C6.2 95.25,46.35 96.2,47.31 96.2,61.91 95.25,62.87 C16.2 93.98,72.39 91.25,75.12 Q7.2 Q9.2
N$7
  Bottom 0.813: K1.1 C26.1
N$8
  Bottom 0.813: R4.1 82.55,56.83 Q8.3 80.64,56.2 C10.1
N$9
  Bottom 0.813: C10.2 80.64,50.48 81.28,51.12 82.55,51.12 83.19,51.75 R2.1
N$10
  Bottom 0.813: R6.1 78.11,58.1 | 78.11,58.1 C7.1 75.88,59.05 C9.1 | 78.11,58.1 Q8.2 79.38,60.01 81.28,61.91 81.28,63.5 80.01,64.77 R8.1
N$11
  Bottom 0.813: Q8.1 83.82,59.37 | 83.82,59.37 Q10.2 | 83.82,59.37 R9.1 R5.1
N$12
  Bottom 0.813: Q10.3 88.27,56.83 | 88.27,56.83 R3.1 | Q11.2 88.9,57.47 88.27,56.83
N$13
  Bottom 0.813: Q11.3 R1.1 90.81,51.44 91.76,50.48 R19.2
N$14
  Bottom 0.813: 90.81,60.33 R5.2 R7.2 R8.2 81.28,67.31 73.98,67.31 73.34,66.67 C8.1 | 90.81,60.33 Q11.1 | Q10.1 86.68,60.33 90.81,60.33
N$15
  Bottom 0.813: C16.1 R19.1
N$16
  Bottom 0.813: R9.2 77.15,62.23 75.88,63.5 C9.2
N$17
  Bottom 0.813: Q13.3 79.06,39.05 | 79.06,39.05 78.42,39.05 Q12.2 | R11.1 79.06,39.05
N$18
  Bottom 0.813: R12.1 75.25,41.27 | 75.25,41.27 C11.2 | Q12.3 75.25,41.27
N$19
  Bottom 0.813: C14.2 71.12,29.84 71.75,29.21 81.28,29.21 | 81.28,29.21 Q13.1 79.69,36.51 78.42,35.24 R16.1 76.52,33.97 75.25,35.24 Q12.1 | 81.28,29.21 89.22,29.21 R17.1 90.81,33.02 91.76,33.97 R14.1
N$20
  Bottom 0.813: K1.10 20.95,49.49 C27.1
N$21
  Bottom 0.61: Q14.2 87.31,37.78
  Bottom 0.813: 87.31,37.78 86.36,38.73 R13.1 C12.2 | Q14.2 92.08,37.78 R14.2
N$22
  Bottom 0.813: C6.1 R10.1 89.85,41.27 88.9,40.32 Q14.3
N$23
  Bottom 0.813: Q14.1 88.58,36.2 R15.2 84.77,36.2 Q13.2
N$24
  Bottom 0.813: R15.1 C13.2 R16.2
N$25
  Bottom 0.813: R18.1 Q15.3 54.29,51.12 54.29,53.98 52.7,55.56 C15.2
N$26
  Bottom 0.813: Q15.2 49.21,50.8 48.26,51.75 R20.2
N$27
  Bottom 0.813: C17.1 49.85,47.62 49.21,48.26 R20.1 46.67,48.26 | 46.67,48.26 R21.1 | 46.67,48.26 45.72,49.21 C18.2 Q16.3
N$28
  Bottom 0.813: R24.1 28.26,62.23 28.26,58.74 32.07,54.93 38.42,54.93 R23.1 43.81,56.52 Q16.1 C19.1 Q15.1
N$29
  Bottom 0.813: C15.1 57.47,64.45 JP1.2
N$30
  Bottom 0.813: R23.2 C18.1 40.01,47.62 40.96,46.67 R22.1 | Q17.2 39.5,51.94 R23.2 | Q16.2 40.96,53.98 40.01,53.02 R23.2
N$31
  Bottom 0.813: Q17.1 31.62,47.12 30.48,48.26 L1.1
N$32
  Bottom 0.813: L1.2 26.04,58.1 K1.5
N$33
  Bottom 0.813: R26.S 25.72,77.15 26.99,78.42 37.47,78.42 38.1,77.79 R25.1
N$34
  Bottom 0.813: Q20.3 90.17,24.45 R27.1
N$35
  Bottom 0.813: R52.2 7.62,52.39 Q27.2
N$36
  Bottom 0.813: D1.A 65.09,65.09 JP1.6
N$37
  Bottom 0.813: D2.C JP1.3
N$38
  Bottom 0.813: 71.75,52.39 C7.2 71.75,59.37 71.12,60.01 D1.C 66.67,60.01 66.04,59.37 D2.A | 71.75,52.39 C11.1 | JP2.2 71.75,52.39
N$39
  Bottom 0.813: JP3.5 JP3.4 45.09,77.47 45.72,78.11 51.94,78.11 Q1.1 Q2.1
N$40
  Bottom 0.813: Q18.D 45.09,71.44 JP3.3
N$41
  Bottom 0.813: Q19.D 50.48,71.44 50.48,74.61 49.53,75.56 JP3.6
N$42
  Bottom 0.61: R25.2 Q18.S Q19.S
  Bottom 0.813: C24.2 R25.2
N$43
  Bottom 0.813: Q19.G 47.62,64.14 43.5,60.01 37.15,60.01 35.56,58.42 32.7,58.42 31.43,59.69 JP4.5
N$44
  Bottom 0.813: Q18.G 42.23,63.5 40.32,61.59 36.83,61.59 35.24,63.18 JP4.4
N$45
  Bottom 0.813: R28.1 R27.2 91.76,21.27 93.03,22.54 C29.-
N$46
  Bottom 0.813: JP4.2 33.97,69.22 32.7,70.48 X1.1
N$47
  Bottom 0.813: Q21.3 86.68,16.83 88.58,16.83 90.17,15.24 R28.2
N$48
  Bottom 0.813: R26.A 19.68,76.52 C25.+ 15.88,77.15 14.92,78.11 10.16,78.11 9.53,77.47 IC1.OUT
N$49
  Bottom 0.813: D3.C D4.A
N$50
  Bottom 0.61: Q21.2 83.82,14.92
  Bottom 0.813: 83.82,14.92 82.55,13.65 | 82.55,13.65 D4.C | 82.55,13.65 81.28,13.65 80.33,14.61 C20.- 76.52,16.83 76.52,18.41 75.56,19.37 Q22.1
N$51
  Bottom 0.813: C20.+ 79.69,18.1 R29.2 79.69,21.27 80.64,22.23 82.55,22.23 | Q20.2 82.55,22.23 | 82.55,22.23 D3.A
N$52
  Bottom 0.813: Q20.1 86.68,25.72 86.04,26.35 80.33,26.35 79.69,25.72 R29.1 77.15,24.77 | 77.15,24.77 R32.1 | 77.15,24.77 C30.+ 71.75,24.77 69.22,22.23 R34.2
N$53
  Bottom 0.813: Q22.3 72.71,15.56 R30.1
N$54
  Bottom 0.813: R30.2 72.71,10.16 74.3,11.75 74.93,11.75 | 74.93,11.75 C21.+ | R31.1 74.93,11.75
N$55
  Bottom 0.813: R32.2 Q22.2 70.48,16.51 R33.1 C28.+
N$56
  Bottom 0.813: C29.+ 95.57,20.32 JP5.2
N$57
  Bottom 0.813: JP7.2 64.77,10.79 65.41,11.43 C28.-
N$58
  Bottom 0.813: Q23.2 C31.+ 43.18,36.2 R35.1
N$59
  Bottom 0.813: R39.2 R41.2 38.42,34.92 | R36.2 38.42,34.92 | Q23.3 40.64,31.43 40.64,33.66 39.37,34.92 38.42,34.92
N$60
  Bottom 0.813: R36.1 R37.2 38.42,28.26 39.37,27.3 C32.+
N$61
  Bottom 0.813: R37.1 38.42,23.81 37.78,23.18 Q24.1 38.73,20.64 C50.+
N$62
  Bottom 0.813: Q24.3 37.15,18.41 35.56,18.41 33.97,20 33.97,22.86 R38.2 31.11,23.81 C33.+
N$63
  Bottom 0.813: Q24.2 R39.1 35.88,27.3 34.29,28.89 34.29,31.11 33.34,32.07 Q25.1
N$64
  Bottom 0.813: R52.1 JP9.1
N$65
  Bottom 0.813: Q25.3 32.7,27.62 29.84,24.77 C35.+ 27.3,22.86 R40.2
N$66
  Bottom 0.813: R41.1 Q25.2 R42.1 27.3,30.8 C36.+
N$67
  Bottom 0.813: R43.1 16.83,29.53 | 16.83,29.53 16.83,29.84 C37.+ | Q26.3 16.83,29.53
N$68
  Bottom 0.813: R44.1 C37.-
N$69
  Bottom 0.813: C38.+ Q26.2 | R45.1 12.7,27.62 Q26.2 | Q26.2 12.7,33.02 R46.2
N$70
  Bottom 0.813: Q26.1 15.24,32.07 16.51,33.34 R47.2 16.51,36.51 17.14,37.15 C41.+
N$71
  Bottom 0.813: R47.1 R46.1 R49.1 10.48,39.69 | C40.+ 9.21,38.42 10.48,39.69 | R48.1 10.48,39.69
N$72
  Bottom 0.813: C39.2 9.84,25.72 JP6.1 C38.- 7.62,32.07 10.16,34.61 R49.2
N$73
  Bottom 0.813: JP7.3 62.23,14.29 64.14,16.19 66.04,16.19 66.99,17.14 66.99,25.08 K2.4
N$74  (via drill 0.5 pad 1.68)
  Top 0.406: v32.38,40.01 v45.09,40.01 | v66.04,53.98 v66.04,48.9
  Bottom 0.813: JP1.4 JP1.5 C22.1 v66.04,53.98 | R60.2 22.86,26.04 | 22.86,26.04 22.23,26.67 C41.- 25.08,40.01 v32.38,40.01 | v66.04,48.9 59.05,48.9 57.15,46.99 57.15,42.23 54.93,40.01 v45.09,40.01 | C35.- 28.26,27.3 26.99,26.04 22.86,26.04
N$75  (via drill 0.5 pad 1.68)
  Top 0.406: v53.34,30.16 v53.34,25.72
  Bottom 0.813: v53.34,25.72 48.58,25.72 46.04,23.18 46.04,20.95 C50.- | K2.6 61.91,32.7 59.37,30.16 v53.34,30.16
N$76
  Bottom 0.813: JP8.1 7.62,13.02 12.06,8.57 18.1,8.57 19.05,7.62 23.81,7.62 26.99,10.79 33.02,10.79 36.51,7.3 Q28.2
N$77
  Bottom 0.813: Q29.1 47.94,8.26 51.44,11.75 58.42,11.75 59.05,12.38 C23.1 59.05,16.19 60.01,17.14 D6.A 62.87,17.14 64.45,18.73 K2.1
N$78
  Bottom 0.813: R50.2 Q29.2 40.64,6.99 39.37,8.26 Q28.1
N$79
  Bottom 0.813: K1.9 D5.A C44.1 Q27.1
N$81
  Bottom 0.813: R51.1 34.61,12.38 35.24,13.02 R61.1 | Q30.3 23.18,9.53 R51.1 | R60.1 22.86,17.14 24.77,15.24 24.77,13.65 R51.1
N$82
  Bottom 0.813: C43.+ 31.11,9.21 R53.1 26.35,7.3 R51.2
N$83
  Bottom 0.813: Q30.1 22.23,14.61 R54.2 20.32,16.51 C49.1
N$84
  Bottom 0.813: R54.1 27.94,13.97 C46.+ 33.97,13.97 35.24,15.24 R55.1
N$85
  Bottom 0.813: Q30.2 19.68,10.79 19.37,11.11 | 19.37,11.11 R56.1 | 19.37,11.11 C47.2 17.78,13.34 16.83,14.29 16.83,18.73 17.78,19.68 R59.1
N$86
  Bottom 0.813: C48.2 C47.1 14.92,12.7 R57.1
N$87
  Bottom 0.813: R58.1 11.75,11.11 9.53,13.34 9.53,15.56 10.48,16.51 11.75,16.51 | C49.2 11.75,16.51 | C48.1 11.75,16.51
N$89
  Bottom 0.813: R59.2 13.02,19.68 12.7,20 JP10.1
N$91  (via drill 0.5 pad 1.68)
  Top 0.406: v50.16,33.34 v50.16,21.59
  Bottom 0.813: K2.8 60.96,37.78 58.42,35.24 52.07,35.24 v50.16,33.34 | R61.2 43.5,13.02 50.16,19.68 v50.16,21.59
N$104
  Bottom 0.813: JP15.1 24.13,82.87 C56.1 20.32,84.77 19.37,85.72 14.29,85.72 12.7,87.31 12.7,97.47 13.65,98.42 K3.10
N$105
  Bottom 0.813: JP24.1 25.4,89.85 26.67,88.58 28.26,88.58 29.21,87.63 JP15.2 31.75,82.87 C58.1 39.37,82.87 JP16.1
N$106
  Bottom 0.813: JP17.1 54.61,82.87 C59.1 46.99,82.87 JP16.2 44.45,88.58 43.5,89.53 JP25.1
N$107
  Bottom 0.813: JP18.1 69.53,82.87 C60.1 62.23,82.87 JP17.2 59.69,88.27 61.28,89.85 JP26.1
N$108  (via drill 0.6 pad 1.68)
  Top 0.813: v86.68,92.08 v86.68,82.87
  Bottom 0.61: K4.10 88.9,98.42 87.31,96.84 87.31,96.2 86.68,95.57 v86.68,92.08
  Bottom 0.813: JP18.2 77.15,82.87 C61.1 v86.68,82.87
N$109
  Bottom 0.813: JP19.1 22.54,100.97 C62.1 19.05,99.69 17.14,99.69 15.88,100.97 12.7,100.97 K3.1
N$110
  Bottom 0.813: JP19.2 30.16,100.97 C63.1 34.92,100.97 JP20.1
N$111
  Bottom 0.813: JP20.2 42.55,100.97 C64.1 46.67,100.97 JP21.1
N$112
  Bottom 0.813: JP21.2 54.29,100.97 C65.1 58.74,100.97 JP22.1
N$113
  Bottom 0.813: JP22.2 66.36,100.97 C66.1 70.8,100.97 JP23.1
N$114
  Bottom 0.813: JP23.2 78.42,100.97 C67.1 80.64,99.38 81.6,98.42 K4.1
N$115
  Bottom 0.813: K4.6 X3.1
N$116
  Bottom 0.813: JP3.2 42.55,80.64 41.91,81.28 19.37,81.28 16.51,84.14 13.34,84.14 10.16,87.31 K3.5
N$117
  Bottom 0.813: JP24.2 30.48,91.44 31.11,92.08 C57.1
N$118
  Bottom 0.813: JP25.2 C68.1
N$119
  Bottom 0.813: C69.1 JP26.2
N$120
  Bottom 0.813: Q39.2 4.45,91.76 3.49,92.71 R64.2
N$121
  Bottom 0.813: JP27.1 R64.1
N$122  (via drill 0.6 pad 1.68)
  Top 0.813: v15.24,92.08 v10.16,92.08 | v18.1,103.82 v18.1,97.47
  Bottom 0.813: K4.9 91.76,95.89 | 91.76,95.89 91.76,100.01 90.81,100.97 D7.A 89.22,101.92 87.31,103.82 v18.1,103.82 | C70.1 91.76,95.89 | v15.24,92.08 K3.9 18.1,95.89 | v10.16,92.08 Q39.1 | v18.1,97.47 18.1,95.89 | 18.1,95.89 C71.1

### Text on the board
Bottom: MINIMA